# Altium project Watchdog.PrjPcb
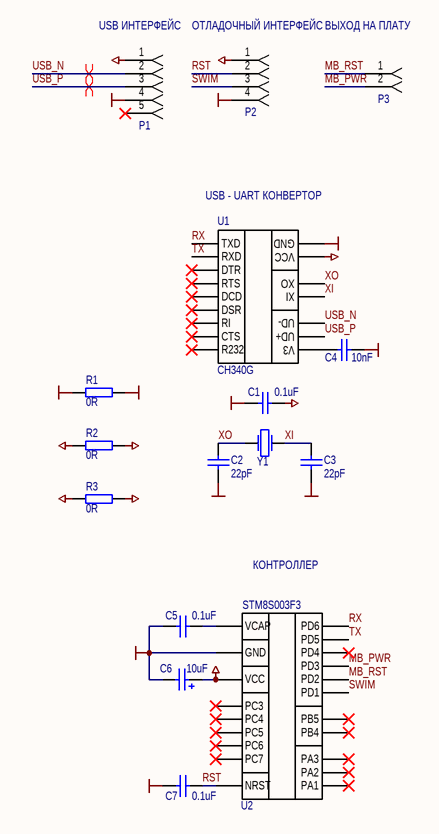
[diagram p0: MainBord.SchDoc]
1 sheet, 16 parts. Net scope: global (net labels, ports and power ports of the same name join across sheets).
Board file: MainBord.PcbDoc

## Sheet MainBord.SchDoc
size 209 x 297 mm; Обозначение документа: АБВГ.123456.001 Э3; Номер листа: 1; Общее количество листов: 1; Литера: P; Наименование организации: ОАО "Ваша фирма"; Перв. применение: АБВГ.123456.000; Наименование изделия 1: Плата; Наименование изделия 2: Схема электрическая; Наименование изделия 3: принципиальная

### Parts
C1  value 0.1uF  [CAP0603]  (hidden comment: CeramicCapacitor)
C2  value 22pF  [CAP0402]  (hidden comment: CeramicCapacitor)
C3  value 22pF  [CAP0402]  (hidden comment: CeramicCapacitor)
C4  value 10nF  [CAP0603]  (hidden comment: CeramicCapacitor)
C5  value 0.1uF  [CAP0603]  (hidden comment: CeramicCapacitor)
C6  value 10uF  [CAP3216]  (hidden comment: TantalumCapacitor)
C7  value 0.1uF  [CAP0603]  (hidden comment: CeramicCapacitor)
P1  Disp  [THT_MALE_1x5]  (value not drawn)
P2  Disp  [653004114822]  (value not drawn)
P3  Disp  [THT_MALE_1x2]  (value not drawn)
R1  value 0R  [RES0805_0_Ohm]  (hidden comment: Resistor)
R2  value 0R  [RES0805_0_Ohm]  (hidden comment: Resistor)
R3  value 0R  [RES0805_0_Ohm]  (hidden comment: Resistor)
U1  CH340G  [SOIC16_CH340G]
U2  STM8S003F3  [TSOP65P640X120-20N]
Y1  XTAL  [SMD3225]  (value not drawn)

### Nets
GND: C1.1 C2.1 C3.1 C4.1 C5.1 C6.1 C7.1 P1.4 P2.4 R1.1 R1.2 U1.1(GND) U2.7(GND)
VCC: C1.2 C6.2 P1.1 P2.1 R2.1 R2.2 R3.1 R3.2 U1.16(VCC) U2.9(VCC)
MB_PWR: P3.2 U2.20(PD3)
MB_RST: P3.1 U2.19(PD2)
RST: C7.2 P2.2 U2.4(NRST)
RX: U1.2(TXD) U2.3(PD6)
SWIM: P2.3 U2.18(PD1)
TX: U1.3(RXD) U2.2(PD5)
USB_N: P1.2 U1.6(UD-)
USB_P: P1.3 U1.5(UD+)
XI: C3.2 U1.7(XI) Y1.3(Out)
XO: C2.2 U1.8(XO) Y1.1(In)
NetC4_2: C4.2 U1.4(V3)
NetC5_2: C5.2 U2.8(VCAP)

Not connected (* = marked no-connect by the designer): P1 5*; U1 9(~{CTS})* 10(~{DSR})* 11(~{RI})* 12(~{DCD})* 13(~{DTR})* 14(~{RTS})* 15(R232)*; U2 1(PD4)* 5(PA1)* 6(PA2)* 10(PA3)* 11(PB5)* 12(PB4)* 13(PC3)* 14(PC4)* 15(PC5)* 16(PC6)* 17(PC7)*

### Layout directives
differential pair: USB_N, USB_P

### Notes on the sheet
- (near P1) USB ИНТЕРФЕЙС
- (near P2) ОТЛАДОЧНЫЙ ИНТЕРФЕЙС
- (near P3) ВЫХОД НА ПЛАТУ
- (near U1) USB - UART КОНВЕРТОР
- КОНТРОЛЛЕР
- Перв. примен.
- Справ. №
- Подп. и дата
- Инв. № дубл.
- Взам. инв. №
- Разраб.
- Изм.
- Лист
- № докум.
- Подп.
- Дата
- Лит.
- Масса
- Масштаб
- Пров.
- Т.контр.
- Листов
- Инв. № подл.
- Утв.
- Н.контр.
- Копировал
- Формат А4
- (in symbol CH340G) DTR; RTS; DCD; DSR; RI; CTS

### Library data of the parts
C1-C5 C7 = CeramicCapacitor: Surface mount ceramic capacitor
C6 = TantalumCapacitor: Surface mount tantalum capacitor
P1 = XH2.54_5PIN
P2 = JST_XH_4PIN
P3 = XH2.54_2PIN
R1-R3 = Resistor: Surface mount resistor
U1 = CH340G: USB to UART Interface
U2 = STM8S003F3: Value line, 16 MHz STM8S 8-bit MCU, 8 Kbyte Flash, 128 byte data  EEPROM, 10-bit ADC, 3 timers, UART, SPI, I²C
Y1 = XTAL: Crystal Oscillator